# Altium schematic sheet OMAPL137-Eval.SchDoc
size A2; PartNumber: PNxxx; Drawn By: Me?
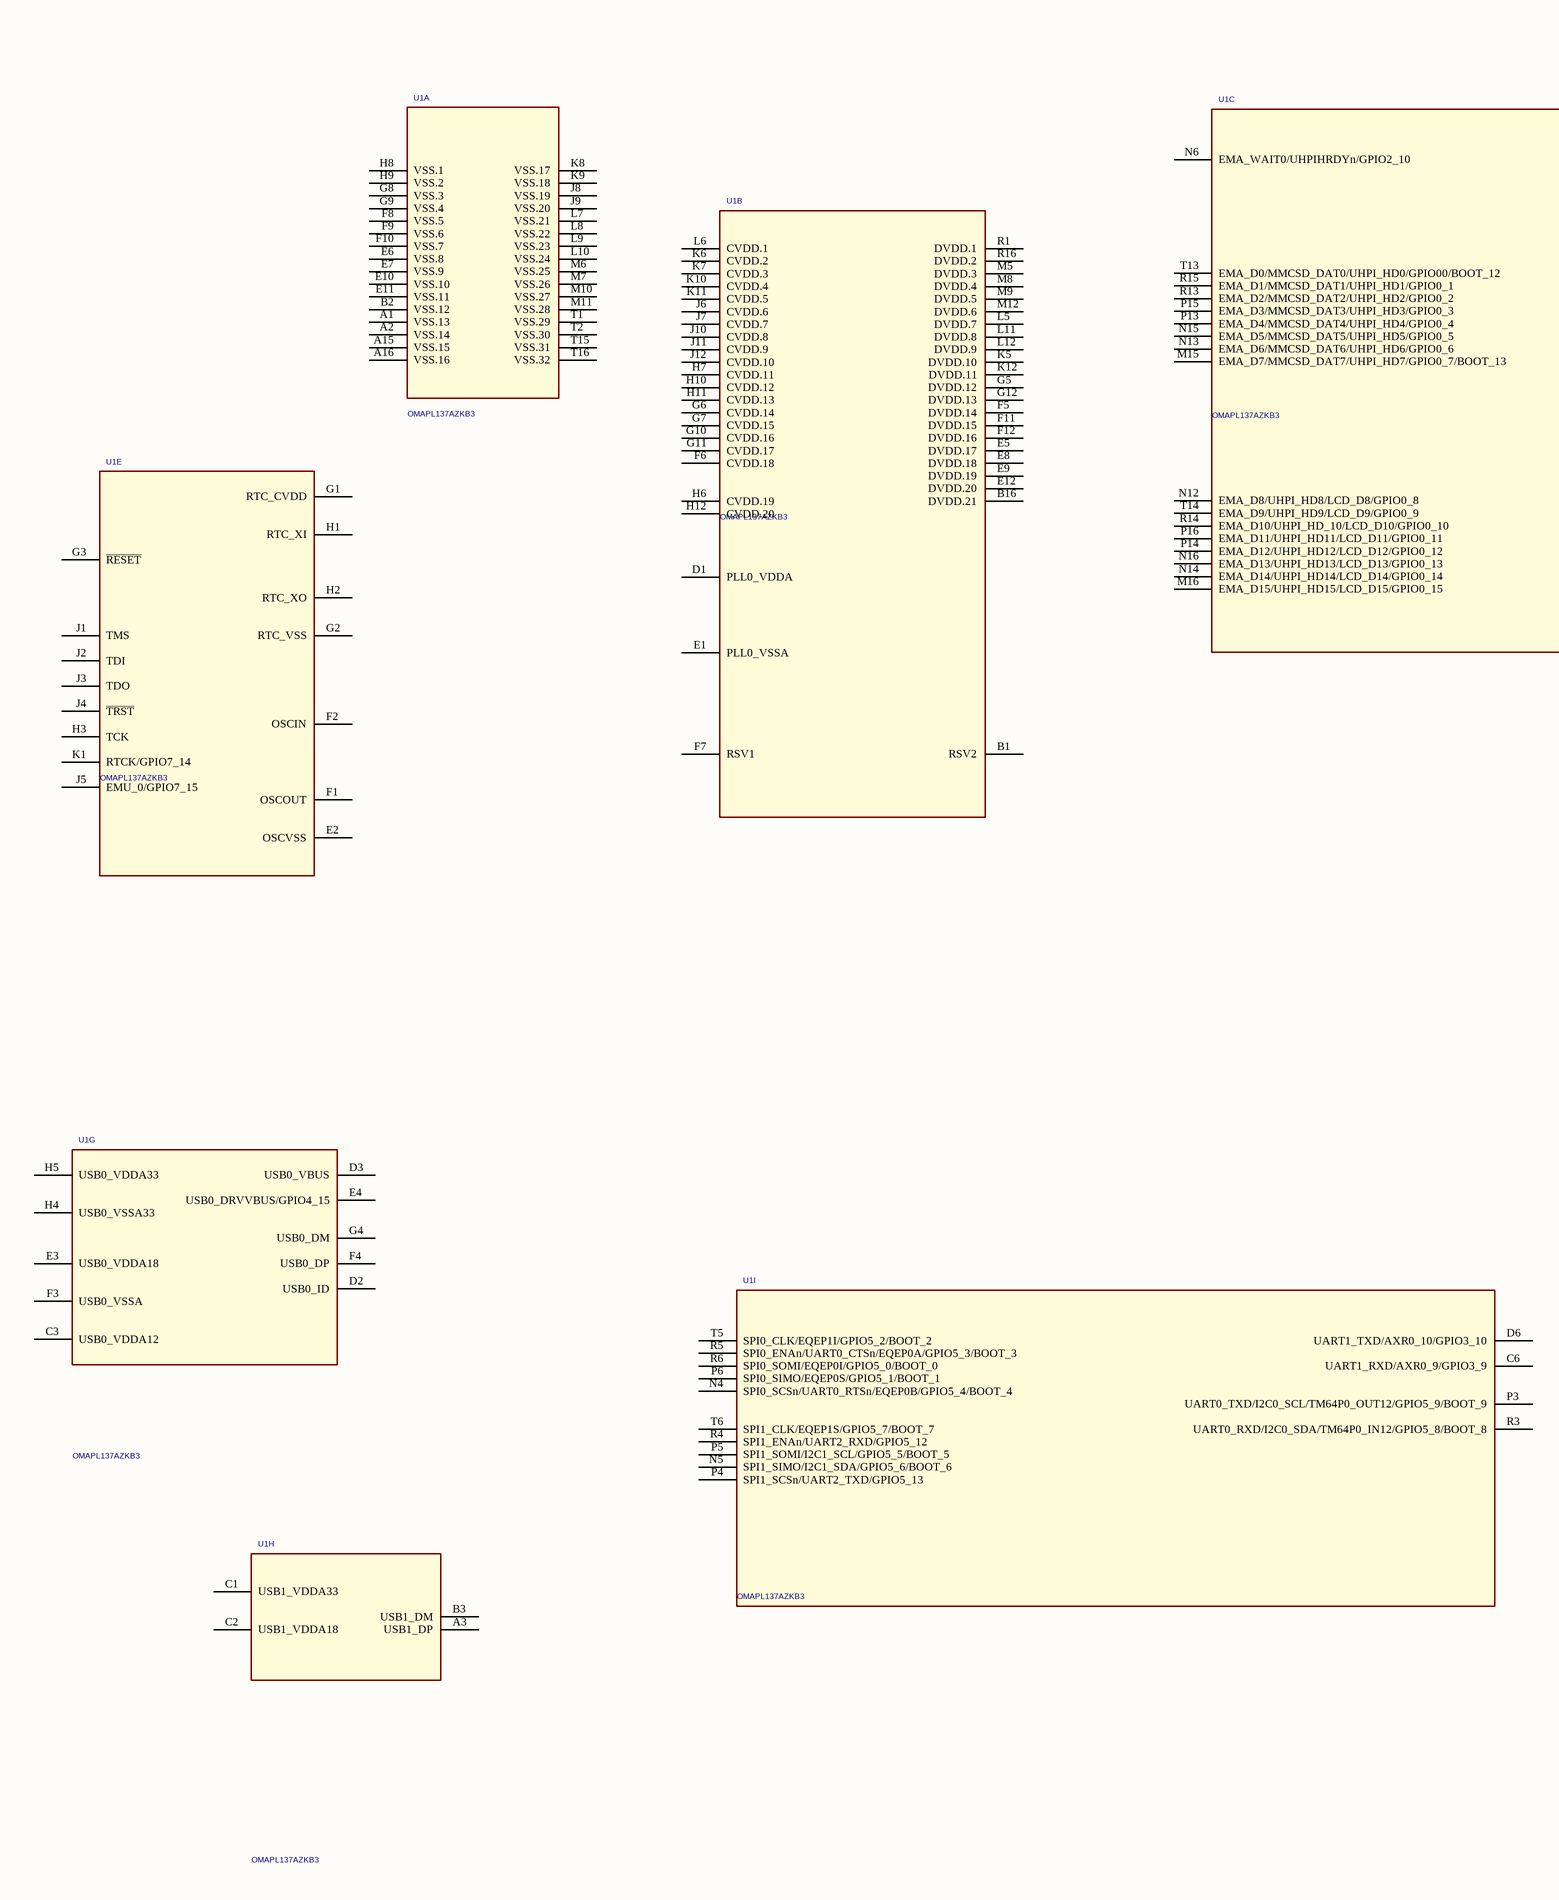
[diagram p0: OMAPL137-Eval.SchDoc, left]
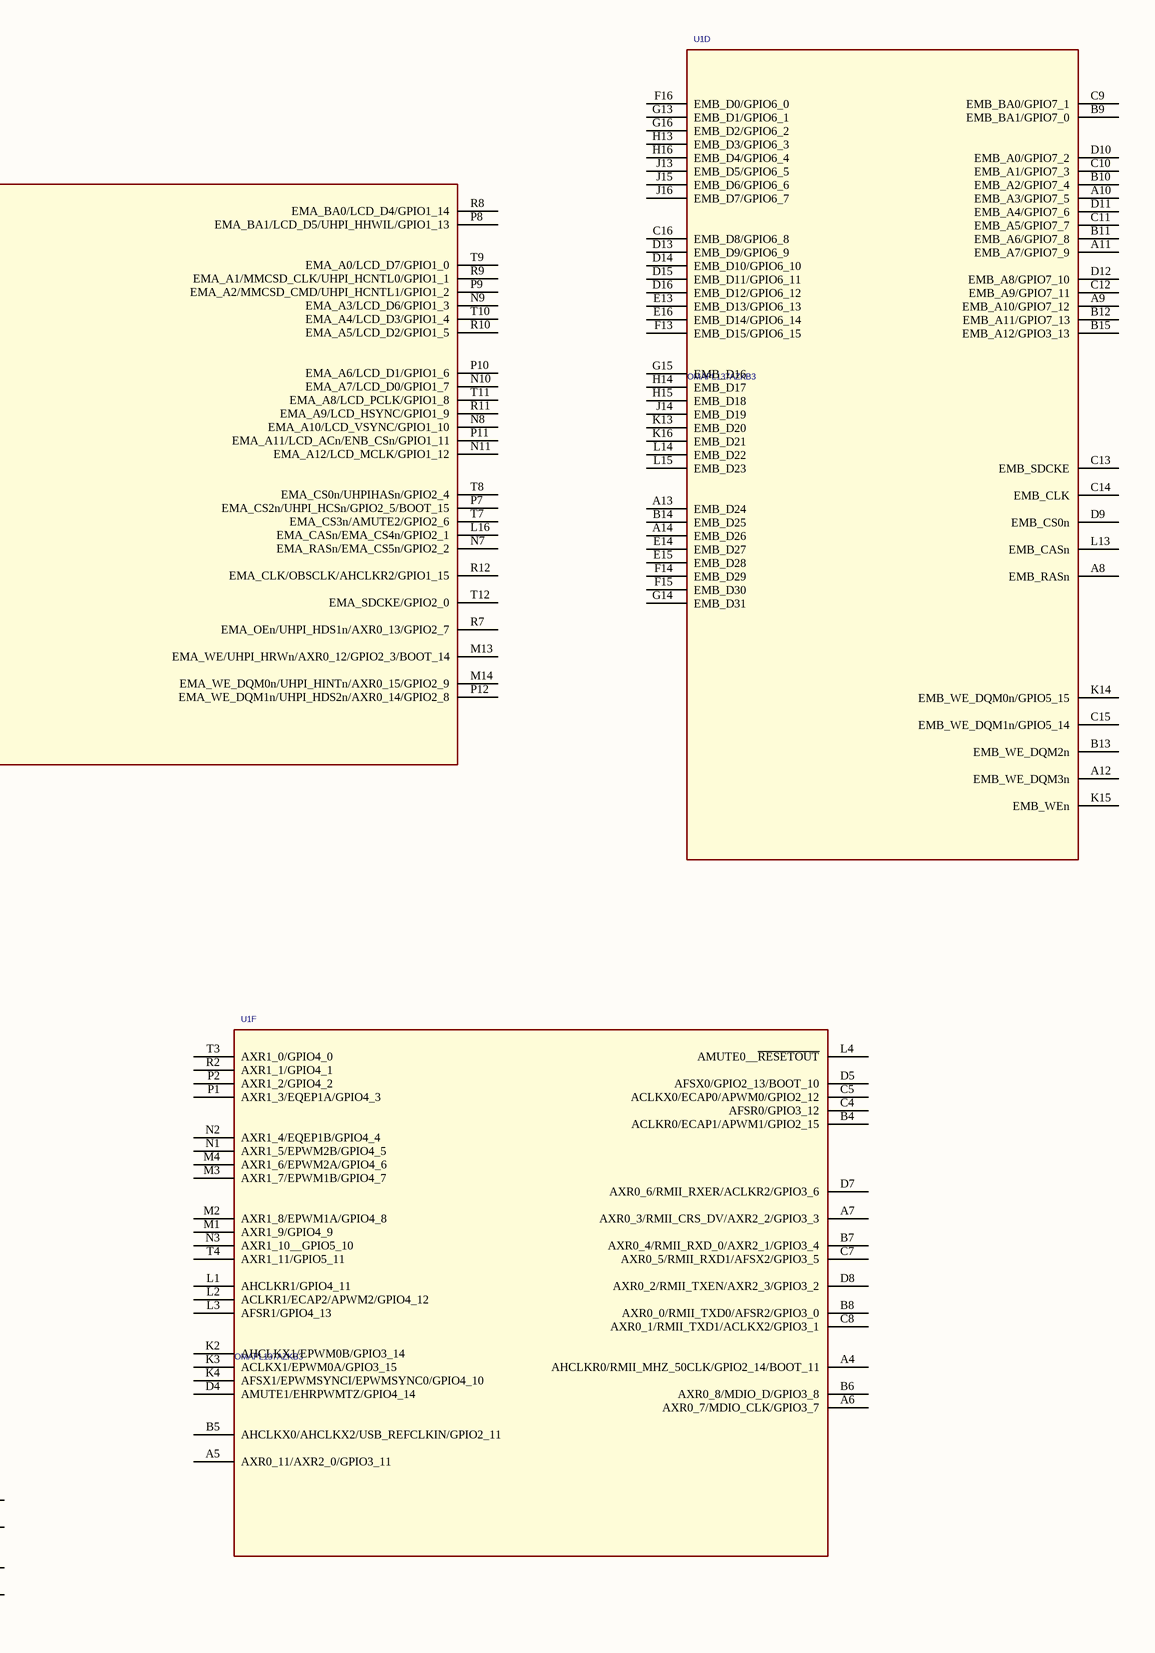
[diagram p1: OMAPL137-Eval.SchDoc, right]

## Parts
U1  OMAPL137AZKB3  [skt256-6064]  (parts A,B,C,D,E,F,G,H,I of 9)

## Nets

Not connected (* = marked no-connect by the designer): U1 A1(VSS.13) A2(VSS.14) A3(USB1_DP) A4(AHCLKR0/RMII_MHZ_50CLK/GPIO2_14/BOOT_11) A5(AXR0_11/AXR2_0/GPIO3_11) A6(AXR0_7/MDIO_CLK/GPIO3_7) A7(AXR0_3/RMII_CRS_DV/AXR2_2/GPIO3_3) A8(EMB_RASn) A9(EMB_A10/GPIO7_12) A10(EMB_A3/GPIO7_5) A11(EMB_A7/GPIO7_9) A12(EMB_WE_DQM3n) A13(EMB_D24) A14(EMB_D26) A15(VSS.15) A16(VSS.16) B1(RSV2) B2(VSS.12) B3(USB1_DM) B4(ACLKR0/ECAP1/APWM1/GPIO2_15) B5(AHCLKX0/AHCLKX2/USB_REFCLKIN/GPIO2_11) B6(AXR0_8/MDIO_D/GPIO3_8) B7(AXR0_4/RMII_RXD_0/AXR2_1/GPIO3_4) B8(AXR0_0/RMII_TXD0/AFSR2/GPIO3_0) B9(EMB_BA1/GPIO7_0) B10(EMB_A2/GPIO7_4) B11(EMB_A6/GPIO7_8) B12(EMB_A11/GPIO7_13) B13(EMB_WE_DQM2n) B14(EMB_D25) B15(EMB_A12/GPIO3_13) B16(DVDD.21) C1(USB1_VDDA33) C2(USB1_VDDA18) C3(USB0_VDDA12) C4(AFSR0/GPIO3_12) C5(ACLKX0/ECAP0/APWM0/GPIO2_12) C6(UART1_RXD/AXR0_9/GPIO3_9) C7(AXR0_5/RMII_RXD1/AFSX2/GPIO3_5) C8(AXR0_1/RMII_TXD1/ACLKX2/GPIO3_1) C9(EMB_BA0/GPIO7_1) C10(EMB_A1/GPIO7_3) C11(EMB_A5/GPIO7_7) C12(EMB_A9/GPIO7_11) C13(EMB_SDCKE) C14(EMB_CLK) C15(EMB_WE_DQM1n/GPIO5_14) C16(EMB_D8/GPIO6_8) D1(PLL0_VDDA) D2(USB0_ID) D3(USB0_VBUS) D4(AMUTE1/EHRPWMTZ/GPIO4_14) D5(AFSX0/GPIO2_13/BOOT_10) D6(UART1_TXD/AXR0_10/GPIO3_10) D7(AXR0_6/RMII_RXER/ACLKR2/GPIO3_6) D8(AXR0_2/RMII_TXEN/AXR2_3/GPIO3_2) D9(EMB_CS0n) D10(EMB_A0/GPIO7_2) D11(EMB_A4/GPIO7_6) D12(EMB_A8/GPIO7_10) D13(EMB_D9/GPIO6_9) D14(EMB_D10/GPIO6_10) D15(EMB_D11/GPIO6_11) D16(EMB_D12/GPIO6_12) E1(PLL0_VSSA) E2(OSCVSS) E3(USB0_VDDA18) E4(USB0_DRVVBUS/GPIO4_15) E5(DVDD.17) E6(VSS.8) E7(VSS.9) E8(DVDD.18) E9(DVDD.19) E10(VSS.10) E11(VSS.11) E12(DVDD.20) E13(EMB_D13/GPIO6_13) E14(EMB_D27) E15(EMB_D28) E16(EMB_D14/GPIO6_14) F1(OSCOUT) F2(OSCIN) F3(USB0_VSSA) F4(USB0_DP) F5(DVDD.14) F6(CVDD.18) F7(RSV1) F8(VSS.5) F9(VSS.6) F10(VSS.7) F11(DVDD.15) F12(DVDD.16) F13(EMB_D15/GPIO6_15) F14(EMB_D29) F15(EMB_D30) F16(EMB_D0/GPIO6_0) G1(RTC_CVDD) G2(RTC_VSS) G3(~{RESET}) G4(USB0_DM) G5(DVDD.12) G6(CVDD.14) G7(CVDD.15) G8(VSS.3) G9(VSS.4) G10(CVDD.16) G11(CVDD.17) G12(DVDD.13) G13(EMB_D1/GPIO6_1) G14(EMB_D31) G15(EMB_D16) G16(EMB_D2/GPIO6_2) H1(RTC_XI) H2(RTC_XO) H3(TCK) H4(USB0_VSSA33) H5(USB0_VDDA33) H6(CVDD.19) H7(CVDD.11) H8(VSS.1) H9(VSS.2) H10(CVDD.12) H11(CVDD.13) H12(CVDD.20) H13(EMB_D3/GPIO6_3) H14(EMB_D17) H15(EMB_D18) H16(EMB_D4/GPIO6_4) J1(TMS) J2(TDI) J3(TDO) J4(~{TRST}) J5(EMU_0/GPIO7_15) J6(CVDD.6) J7(CVDD.7) J8(VSS.19) J9(VSS.20) J10(CVDD.8) J11(CVDD.9) J12(CVDD.10) J13(EMB_D5/GPIO6_5) J14(EMB_D19) J15(EMB_D6/GPIO6_6) J16(EMB_D7/GPIO6_7) K1(RTCK/GPIO7_14) K2(AHCLKX1/EPWM0B/GPIO3_14) K3(ACLKX1/EPWM0A/GPIO3_15) K4(AFSX1/EPWMSYNCI/EPWMSYNC0/GPIO4_10) K5(DVDD.10) K6(CVDD.2) K7(CVDD.3) K8(VSS.17) K9(VSS.18) K10(CVDD.4) K11(CVDD.5) K12(DVDD.11) K13(EMB_D20) K14(EMB_WE_DQM0n/GPIO5_15) K15(EMB_WEn) K16(EMB_D21) L1(AHCLKR1/GPIO4_11) L2(ACLKR1/ECAP2/APWM2/GPIO4_12) L3(AFSR1/GPIO4_13) L4(AMUTE0__~{RESETOUT}) L5(DVDD.7) L6(CVDD.1) L7(VSS.21) L8(VSS.22) L9(VSS.23) L10(VSS.24) L11(DVDD.8) L12(DVDD.9) L13(EMB_CASn) L14(EMB_D22) L15(EMB_D23) L16(EMA_CASn/EMA_CS4n/GPIO2_1) M1(AXR1_9/GPIO4_9) M2(AXR1_8/EPWM1A/GPIO4_8) M3(AXR1_7/EPWM1B/GPIO4_7) M4(AXR1_6/EPWM2A/GPIO4_6) M5(DVDD.3) M6(VSS.25) M7(VSS.26) M8(DVDD.4) M9(DVDD.5) M10(VSS.27) M11(VSS.28) M12(DVDD.6) M13(EMA_WE/UHPI_HRWn/AXR0_12/GPIO2_3/BOOT_14) M14(EMA_WE_DQM0n/UHPI_HINTn/AXR0_15/GPIO2_9) M15(EMA_D7/MMCSD_DAT7/UHPI_HD7/GPIO0_7/BOOT_13) M16(EMA_D15/UHPI_HD15/LCD_D15/GPIO0_15) N1(AXR1_5/EPWM2B/GPIO4_5) N2(AXR1_4/EQEP1B/GPIO4_4) N3(AXR1_10__GPIO5_10) N4(SPI0_SCSn/UART0_RTSn/EQEP0B/GPIO5_4/BOOT_4) N5(SPI1_SIMO/I2C1_SDA/GPIO5_6/BOOT_6) N6(EMA_WAIT0/UHPIHRDYn/GPIO2_10) N7(EMA_RASn/EMA_CS5n/GPIO2_2) N8(EMA_A10/LCD_VSYNC/GPIO1_10) N9(EMA_A3/LCD_D6/GPIO1_3) N10(EMA_A7/LCD_D0/GPIO1_7) N11(EMA_A12/LCD_MCLK/GPIO1_12) N12(EMA_D8/UHPI_HD8/LCD_D8/GPIO0_8) N13(EMA_D6/MMCSD_DAT6/UHPI_HD6/GPIO0_6) N14(EMA_D14/UHPI_HD14/LCD_D14/GPIO0_14) N15(EMA_D5/MMCSD_DAT5/UHPI_HD5/GPIO0_5) N16(EMA_D13/UHPI_HD13/LCD_D13/GPIO0_13) P1(AXR1_3/EQEP1A/GPIO4_3) P2(AXR1_2/GPIO4_2) P3(UART0_TXD/I2C0_SCL/TM64P0_OUT12/GPIO5_9/BOOT_9) P4(SPI1_SCSn/UART2_TXD/GPIO5_13) P5(SPI1_SOMI/I2C1_SCL/GPIO5_5/BOOT_5) P6(SPI0_SIMO/EQEP0S/GPIO5_1/BOOT_1) P7(EMA_CS2n/UHPI_HCSn/GPIO2_5/BOOT_15) P8(EMA_BA1/LCD_D5/UHPI_HHWIL/GPIO1_13) P9(EMA_A2/MMCSD_CMD/UHPI_HCNTL1/GPIO1_2) P10(EMA_A6/LCD_D1/GPIO1_6) P11(EMA_A11/LCD_ACn/ENB_CSn/GPIO1_11) P12(EMA_WE_DQM1n/UHPI_HDS2n/AXR0_14/GPIO2_8) P13(EMA_D4/MMCSD_DAT4/UHPI_HD4/GPIO0_4) P14(EMA_D12/UHPI_HD12/LCD_D12/GPIO0_12) P15(EMA_D3/MMCSD_DAT3/UHPI_HD3/GPIO0_3) P16(EMA_D11/UHPI_HD11/LCD_D11/GPIO0_11) R1(DVDD.1) R2(AXR1_1/GPIO4_1) R3(UART0_RXD/I2C0_SDA/TM64P0_IN12/GPIO5_8/BOOT_8) R4(SPI1_ENAn/UART2_RXD/GPIO5_12) R5(SPI0_ENAn/UART0_CTSn/EQEP0A/GPIO5_3/BOOT_3) R6(SPI0_SOMI/EQEP0I/GPIO5_0/BOOT_0) R7(EMA_OEn/UHPI_HDS1n/AXR0_13/GPIO2_7) R8(EMA_BA0/LCD_D4/GPIO1_14) R9(EMA_A1/MMCSD_CLK/UHPI_HCNTL0/GPIO1_1) R10(EMA_A5/LCD_D2/GPIO1_5) R11(EMA_A9/LCD_HSYNC/GPIO1_9) R12(EMA_CLK/OBSCLK/AHCLKR2/GPIO1_15) R13(EMA_D2/MMCSD_DAT2/UHPI_HD2/GPIO0_2) R14(EMA_D10/UHPI_HD_10/LCD_D10/GPIO0_10) R15(EMA_D1/MMCSD_DAT1/UHPI_HD1/GPIO0_1) R16(DVDD.2) T1(VSS.29) T2(VSS.30) T3(AXR1_0/GPIO4_0) T4(AXR1_11/GPIO5_11) T5(SPI0_CLK/EQEP1I/GPIO5_2/BOOT_2) T6(SPI1_CLK/EQEP1S/GPIO5_7/BOOT_7) T7(EMA_CS3n/AMUTE2/GPIO2_6) T8(EMA_CS0n/UHPIHASn/GPIO2_4) T9(EMA_A0/LCD_D7/GPIO1_0) T10(EMA_A4/LCD_D3/GPIO1_4) T11(EMA_A8/LCD_PCLK/GPIO1_8) T12(EMA_SDCKE/GPIO2_0) T13(EMA_D0/MMCSD_DAT0/UHPI_HD0/GPIO00/BOOT_12) T14(EMA_D9/UHPI_HD9/LCD_D9/GPIO0_9) T15(VSS.31) T16(VSS.32)

## Notes on the sheet
- Title
- Size:
- Date:
- File:
- A2
- Number:
- Time:
- Revision:
- Sheet
- of

## Library data of the parts
U1 = PRIMUS_BGA_1: Part #: 102772-0001; SWAP_INFO: (S1+S2+S3+S4+S5+S6+S7+S8+S9); SPLIT_INST: TRUE